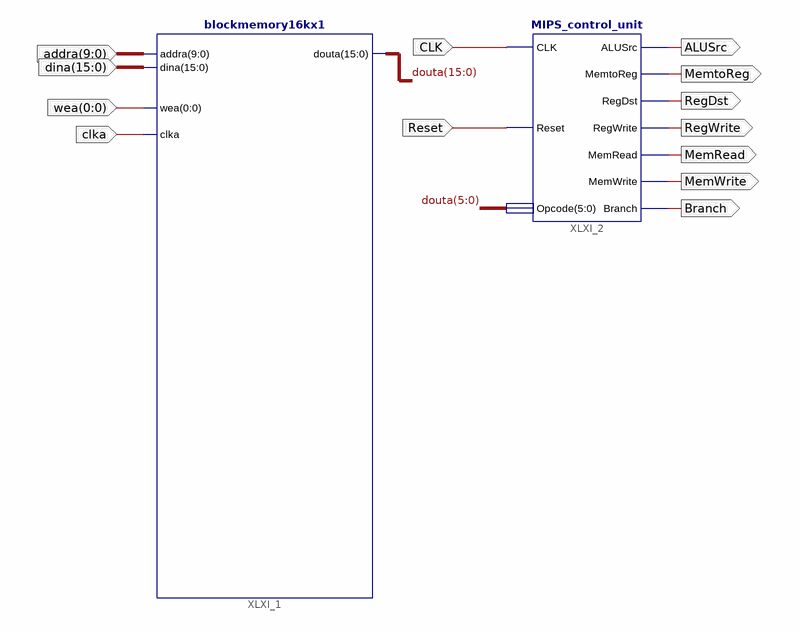
[diagram p0: schematic sheet 1]
// Xilinx ISE schematic ConnectedComponents.sch (spartan3e) as structural Verilog: 2 symbols, 13 ports
module ConnectedComponents (
  input  [9:0] addra,
  input  [15:0] dina,
  input  [0:0] wea,
  input  clka,
  input  Reset,
  input  CLK,
  output ALUSrc,
  output MemtoReg,
  output RegDst,
  output RegWrite,
  output MemRead,
  output MemWrite,
  output Branch
);

  wire [15:0] douta;

  blockmemory16kx1 XLXI_1 (.addra(addra), .dina(dina), .wea(wea[0]), .clka(clka), .douta(douta));
  MIPS_control_unit XLXI_2 (
    .CLK(CLK), .Reset(Reset), .Opcode(douta[5:0]), .ALUSrc(ALUSrc), .MemtoReg(MemtoReg), .RegDst(RegDst),
    .RegWrite(RegWrite), .MemRead(MemRead), .MemWrite(MemWrite), .Branch(Branch));
endmodule
